# Altium schematic sheet Main.SchDoc: param:Title
size A4; Author: param:Autor; Wersja: param:Wersja
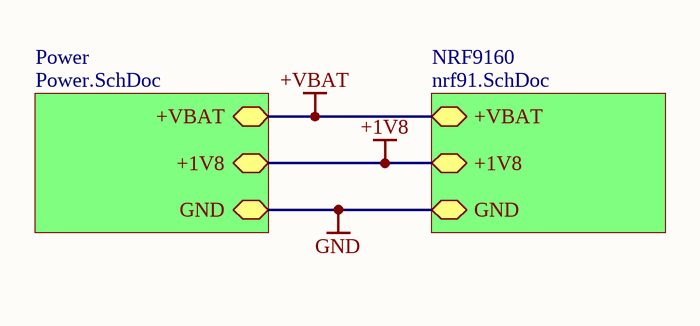
[diagram p0: Main.SchDoc]

## Sub-sheets
NRF9160 = nrf91.SchDoc: GND (bidir), +VBAT (bidir), +1V8 (bidir)
Power = Power.SchDoc: GND (bidir), +VBAT (bidir), +1V8 (bidir)

## Nets
+1V8: sheet NRF9160/+1V8, sheet Power/+1V8
+VBAT: sheet NRF9160/+VBAT, sheet Power/+VBAT
GND: sheet NRF9160/GND, sheet Power/GND

## Notes on the sheet
- Project:
- Copyright
- ©
- AMC
- Designers:
- Subject:
- Variant:
- Data:
- Version:
- Sheet:
- /